# EAGLE design Ghidorah5_v2 (EAGLE 7.7.0)
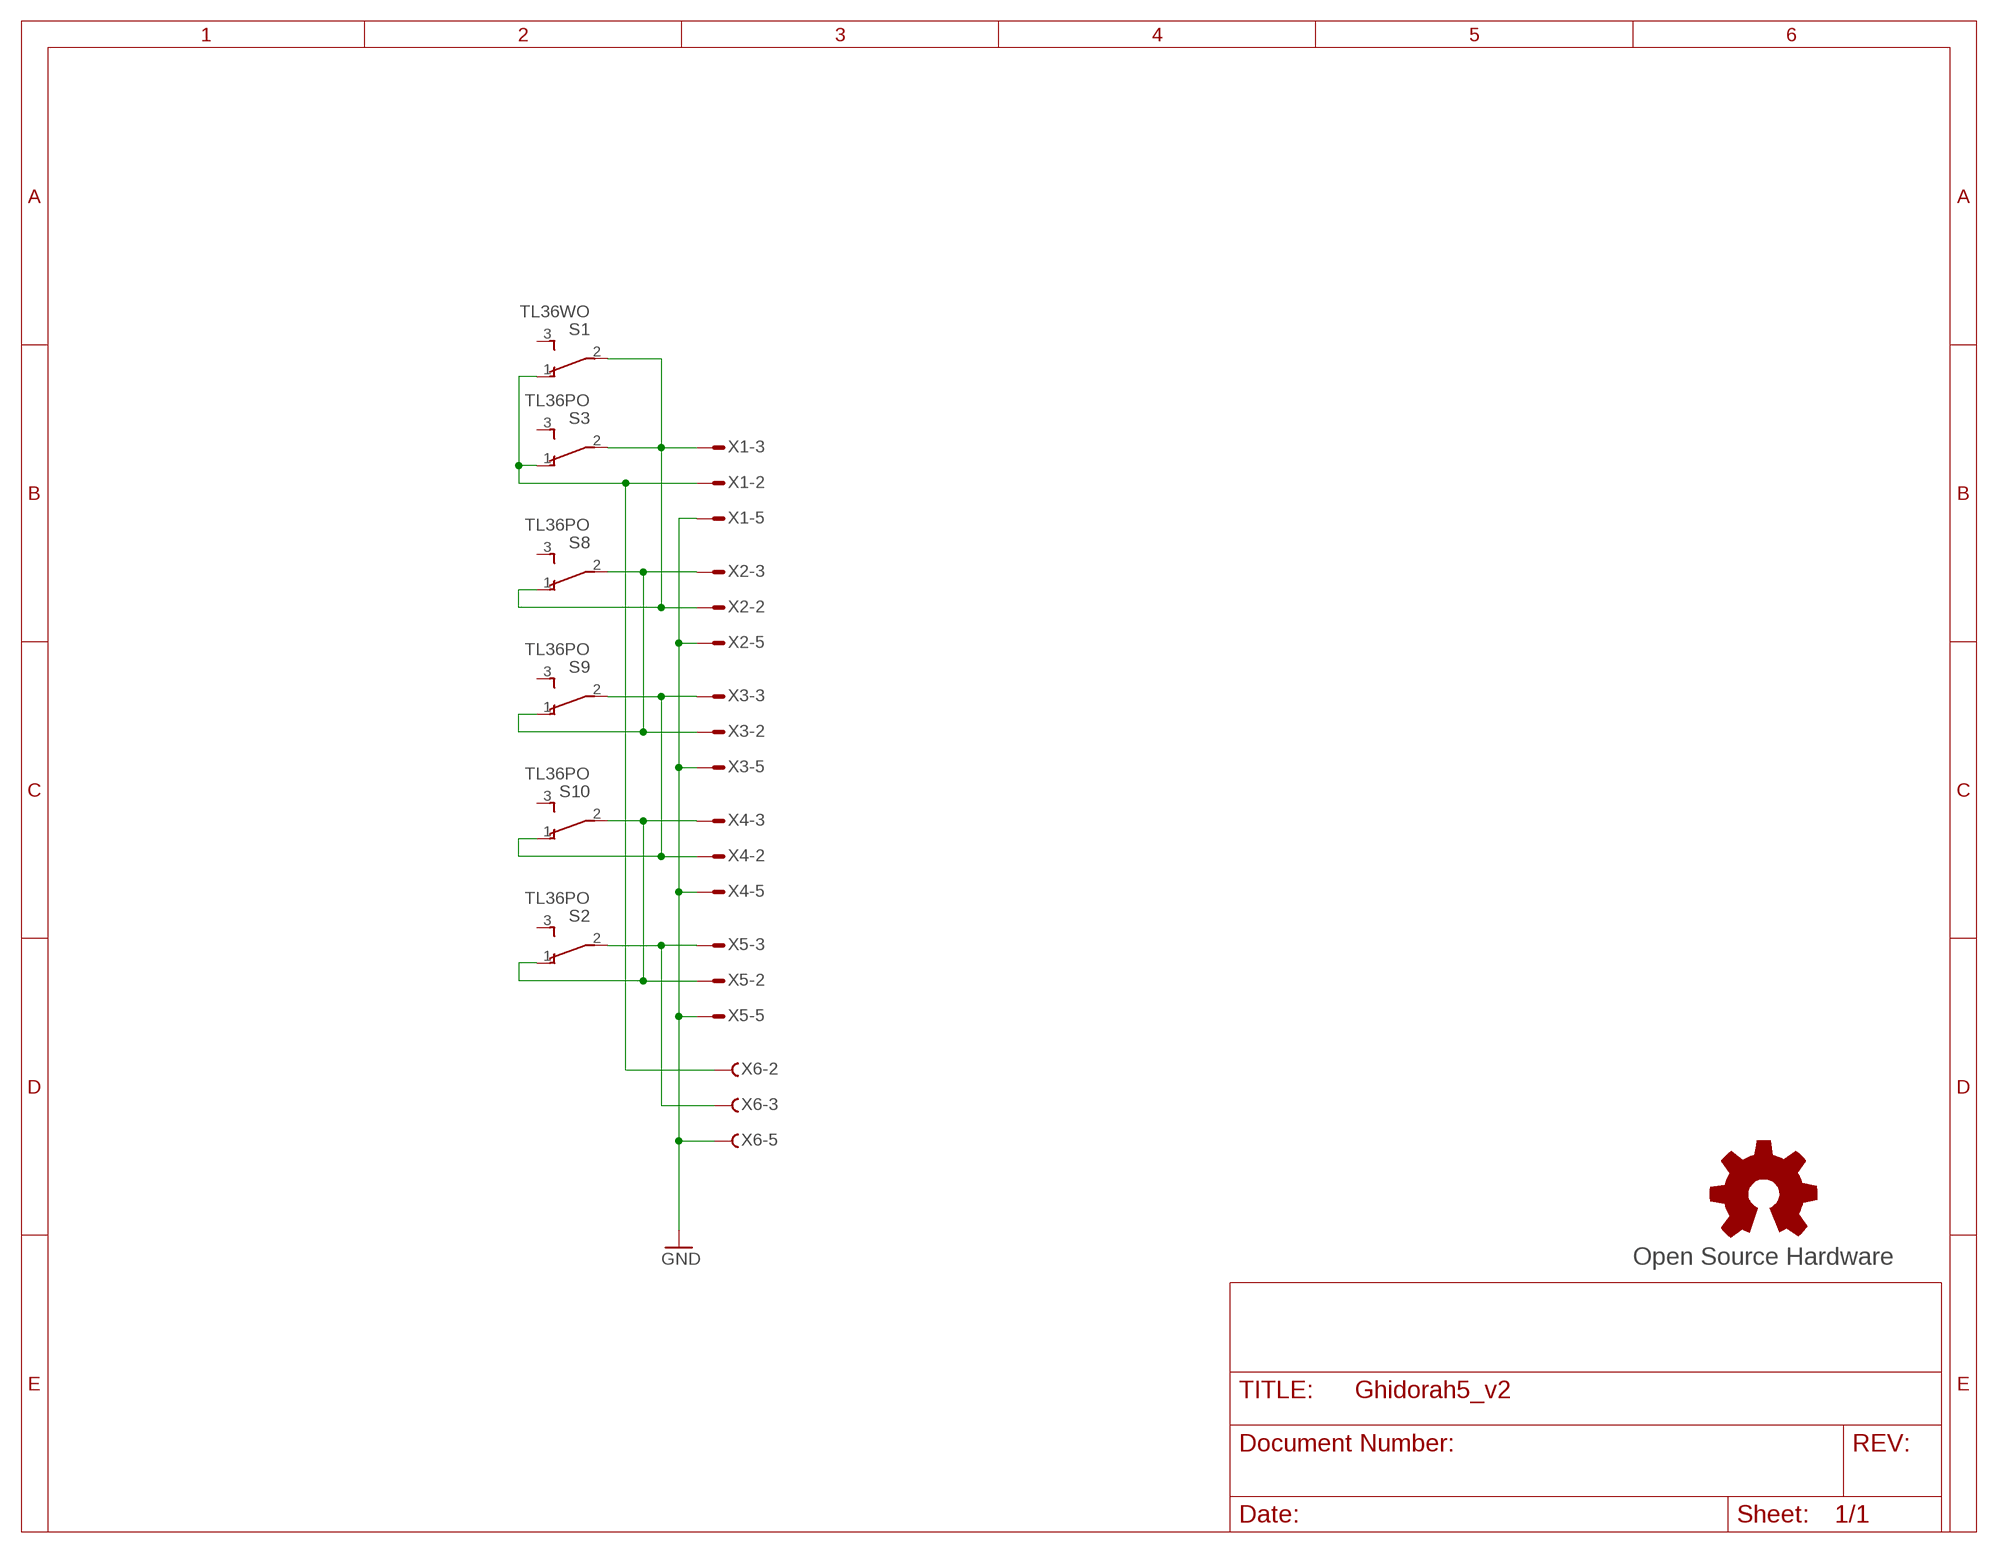
[diagram p0: schematic, sheet 1]

## Parts
GOLD_ORB_SM1  Open Source Hardware  OSHWLOGOLOGO5MM  [OSHW_5MM]
S1  TL36WO  [TL3XWO]
S2  TL36PO  [TL3XPO]
S3  TL36PO  [TL3XPO]
S8  TL36PO  [TL3XPO]
S9  TL36PO  [TL3XPO]
S10  TL36PO  [TL3XPO]
X1  M09DS  [M09D]
X2  M09VS  [M09V]
X3  M09VS  [M09V]
X4  M09VS  [M09V]
X5  M09VS  [M09V]
X6  F09DS  [F09D]

## Nets
2M: S1.1(O) S3.1(O) X1.2 X6.2
3F: S2.2(P) X5.3 X6.3
GND: X1.5 X2.5 X3.5 X4.5 X5.5 X6.5
N$1: S1.2(P) S3.2(P) S8.1(O) X1.3 X2.2
N$2: S8.2(P) S9.1(O) X2.3 X3.2
N$3: S9.2(P) S10.1(O) X3.3 X4.2
N$4: S2.1(O) S10.2(P) X4.3 X5.2
Unconnected: S1.3(S) S2.3(S) S3.3(S) S8.3(S) S9.3(S) S10.3(S) X1.1 X1.4 X1.6 X1.7 X1.8 X1.9 X2.1 X2.4 X2.6 X2.7 X2.8 X2.9 X3.1 X3.4 X3.6 X3.7 X3.8 X3.9 X4.1 X4.4 X4.6 X4.7 X4.8 X4.9 X5.1 X5.4 X5.6 X5.7 X5.8 X5.9 X6.1 X6.4 X6.6 X6.7 X6.8 X6.9

## Library data of the parts
GOLD_ORB_SM1 = oshw:OSHWLOGO: The OSHW logo for PCB layout
S1 = switch:TL36WO: TINY SWITCH ON - ON Source: http://www2.produktinfo.conrad.com/datenblaetter/700000-724999/705152-da-01-de-Subminiaturschalter_TL_36WO.pdf
S2 S3 S8-S10 = switch:TL36PO: TINY SWITCH ON - ON Source: http://www2.produktinfo.conrad.com/datenblaetter/700000-724999/705152-da-01-de-Subminiaturschalter_TL_36YO.pdf
X1-X5 = con-subd:M09?S: SUB-D; OC_FARNELL: unknown; OC_NEWARK: unknown
X6 = con-subd:F09?S: SUB-D; OC_FARNELL: unknown; OC_NEWARK: unknown

## Board
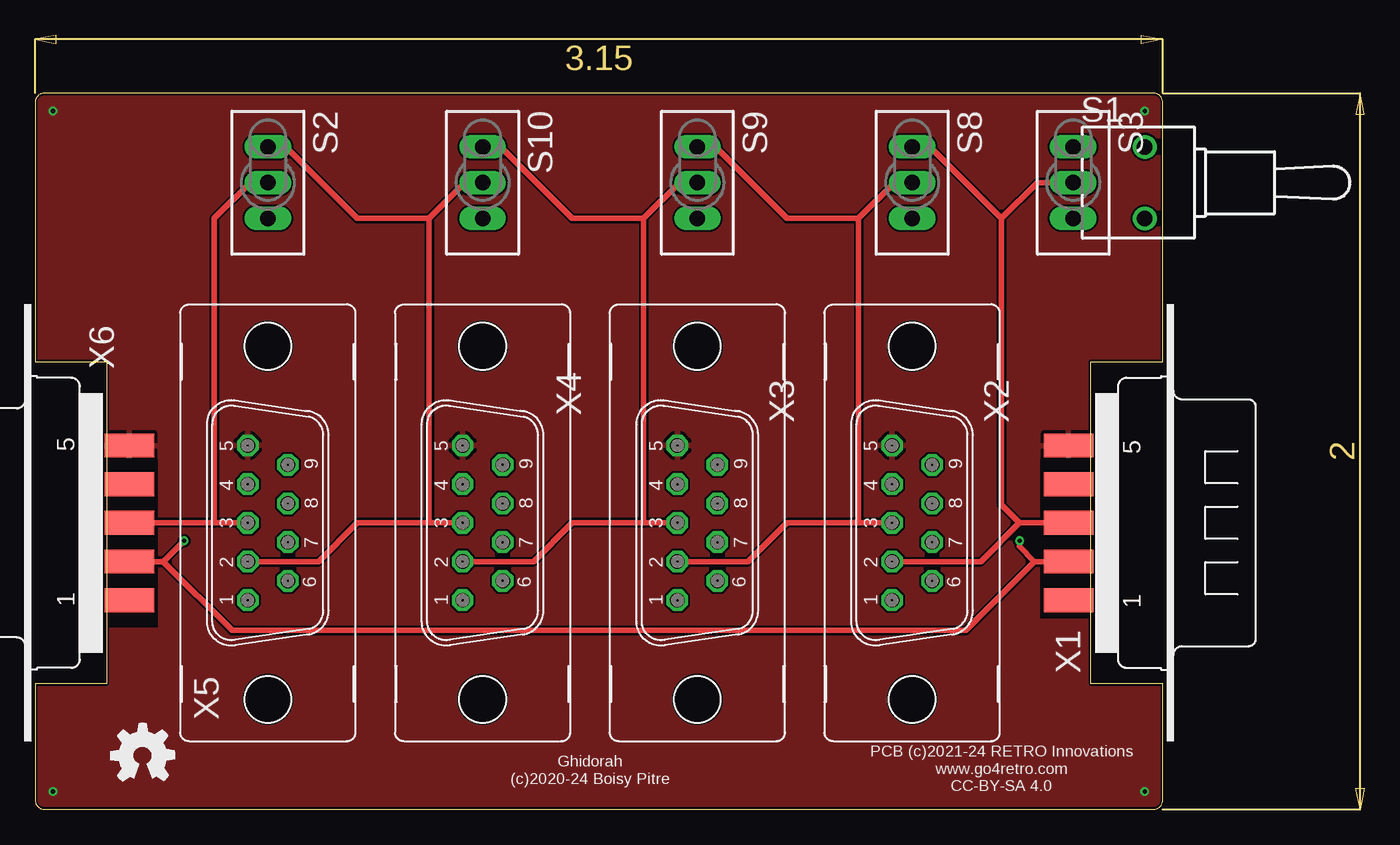
[diagram p1: board, top side]
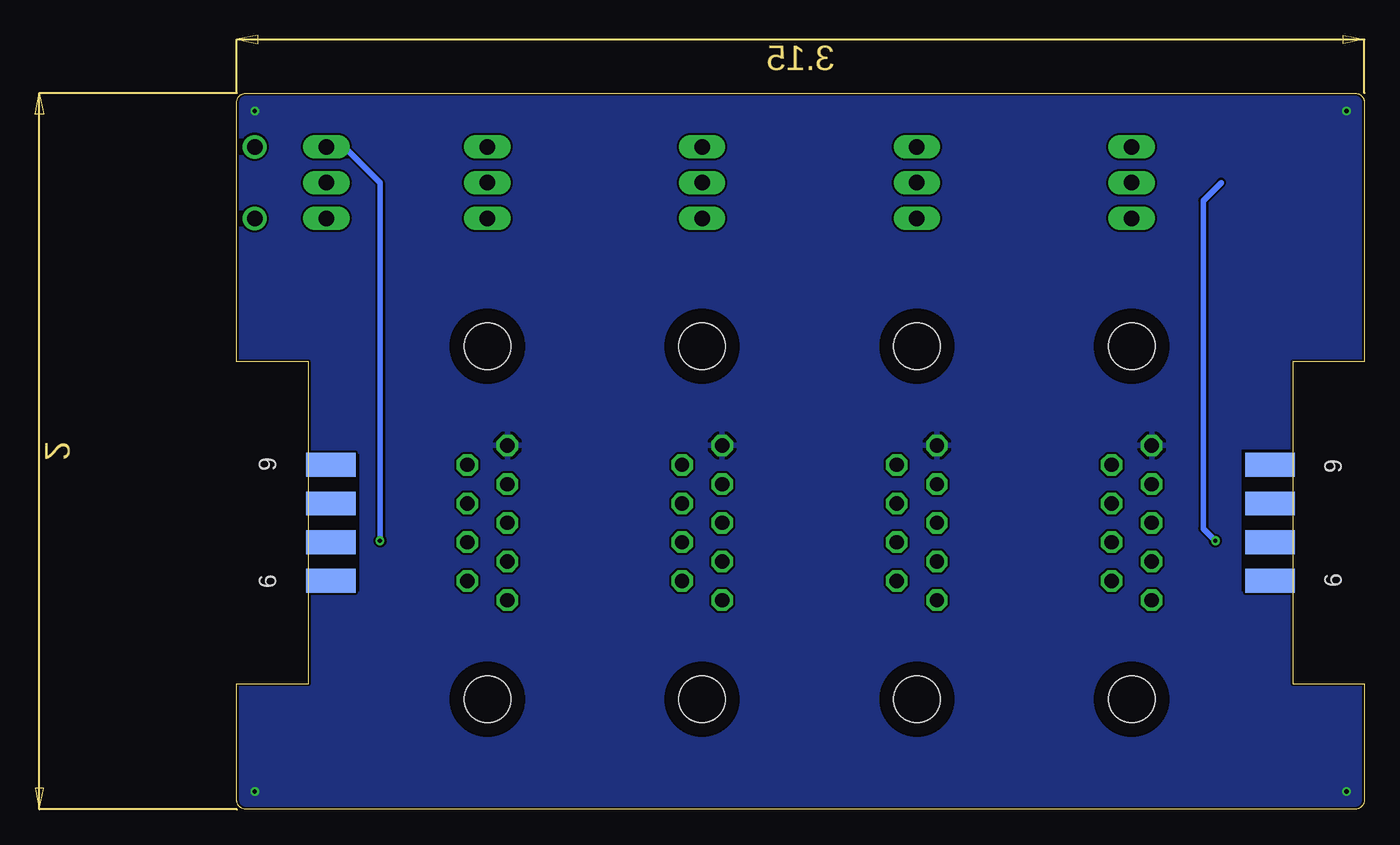
[diagram p2: board, bottom side, seen from below]

Size 80.01 x 50.8 mm. Coordinates in mm from the lower left corner, seen from the top.
Outline: 0.63,0 79.38,0 arc90 80.01,0.64 80.01,8.89 74.93,8.89 74.93,31.75 80.01,31.75 80.01,50.16 arc90 79.38,50.8 0.63,50.8 arc90 0,50.16 0,31.75 5.08,31.75 5.08,8.89 0,8.89 0,0.64 arc90 0.63,0
Copper layers (1*16): Top 0.035mm / dielectric 1.5mm / Bottom 0.035mm
Design rules "hackvana *": minimum track width 6mil, minimum drill 0.3mm, track to track 6mil, track to pad 6mil, pad to pad 6mil, via to via 6mil, smd to smd 0mil, copper to edge 6mil, drill to drill 6mil, minimum pad ring 10mil, minimum via ring 6mil, stop-mask expansion 2mil, vias tented up to drill 100mil, thermal gap 10mil

### Footprints (pad centres in the part's own frame; a part is rotated, then mirrored left to right if it is on the bottom)
TL3XWO = drill 1.1 pad 1.422 long: 1 -2.54,-5.08; 2 0,-5.08; 3 2.54,-5.08 | drill 1.1 pad 1.676: M1 -2.54,0; M2 2.54,0
TL3XPO = drill 1.1 pad 1.422 long: 1 -2.54,0; 2 0,0; 3 2.54,0
M09D = smd 1.7 x 3.5: 1 5.486,-6.045; 2 2.743,-6.045; 3 0,-6.045; 4 -2.743,-6.045; 5 -5.486,-6.045 | smd 1.7 x 3.5 bottom: 6 4.115,-6.045; 7 1.372,-6.045; 8 -1.372,-6.045; 9 -4.115,-6.045
M09V = drill 1.016 octagon: 1 -5.486,1.422; 2 -2.743,1.422; 3 0,1.422; 4 2.743,1.422; 5 5.486,1.422; 6 -4.115,-1.422; 7 -1.372,-1.422; 8 1.372,-1.422; 9 4.115,-1.422 | hole 3.302: -12.522,0; 12.522,0
F09D = smd 1.7 x 3.5: 1 -5.486,-6.045; 2 -2.743,-6.045; 3 0,-6.045; 4 2.743,-6.045; 5 5.486,-6.045 | smd 1.7 x 3.5 bottom: 6 -4.115,-6.045; 7 -1.372,-6.045; 8 1.372,-6.045; 9 4.115,-6.045

### Placement (x,y rotation side)
GOLD_ORB_SM1  7.62,3.81 0 top
S1  78.74,44.45 270 top
S2  16.51,44.45 270 top
S3  73.66,44.45 270 top
S8  62.23,44.45 270 top
S9  46.99,44.45 270 top
S10  31.75,44.45 270 top
X1  79.38,20.32 270 top
X2  62.23,20.32 90 top
X3  46.99,20.32 90 top
X4  31.75,20.32 90 top
X5  16.51,20.32 90 top
X6  0.63,20.32 90 top

### Tracks (layer width: path | path; a pad name or v marks a point on that pad's centre or on a via)
2M  (via drill 0.3)
  Top 0.406: X6.2 9.09,17.58 | 9.09,17.58 13.97,12.7 66.04,12.7 70.92,17.58 | X1.2 70.92,17.58 | 9.09,17.58 v10.57,19.05 | 70.92,17.58 69.85,18.64 v69.85,19.05
  Bottom 0.406: 10.16,44.45 11.43,43.18 11.43,19.91 v10.57,19.05 | v69.85,19.05 69.85,44.45 72.39,46.99 S1.1
3F
  Top 0.406: X5.3 12.7,20.32 | 12.7,20.32 X6.3 | S2.2 15.24,44.45 12.7,41.91 12.7,20.32
GND  (via drill 0.3)
  other vias: 78.74,49.53 1.27,49.53 1.27,1.27 78.74,1.27
  pour Top: 80.01,8.89 80.01,0.64 arc-90 79.38,0 0.63,0 arc-90 0,0.64 0,8.89 5.08,8.89 5.08,12.7 8.89,12.7 8.89,25.08 5.08,25.08 5.08,31.75 0,31.75 0,50.16 arc-90 0.63,50.8 79.38,50.8 arc-90 80.01,50.16 80.01,31.75 74.93,31.75 74.93,25.08 71.12,25.08 71.12,13.34 74.93,13.34 74.93,8.89
  pour Bottom: 80.01,8.89 80.01,0.64 arc-90 79.38,0 0.63,0 arc-90 0,0.64 0,8.89 5.08,8.89 5.08,15.24 8.89,15.24 8.89,25.72 5.08,25.72 5.08,31.75 0,31.75 0,50.16 arc-90 0.63,50.8 79.38,50.8 arc-90 80.01,50.16 80.01,31.75 74.93,31.75 74.93,25.4 71.12,25.4 71.12,15.24 74.93,15.24 74.93,8.89
N$1
  Top 0.406: X2.2 67.11,17.58 69.85,20.32 | X1.3 69.85,20.32 | 68.58,41.91 71.12,44.45 S1.2 | 68.58,41.91 68.58,21.59 69.85,20.32 | S8.1 63.5,46.99 68.58,41.91
N$2
  Top 0.406: X2.3 58.42,20.32 | 58.42,20.32 53.34,20.32 50.6,17.58 X3.2 | S8.2 60.96,44.45 58.42,41.91 | 58.42,41.91 58.42,20.32 | S9.1 48.26,46.99 53.34,41.91 58.42,41.91
N$3
  Top 0.406: X3.3 43.18,20.32 | 43.18,20.32 38.1,20.32 35.36,17.58 X4.2 | S9.2 45.72,44.45 43.18,41.91 | 43.18,41.91 43.18,20.32 | S10.1 33.02,46.99 38.1,41.91 43.18,41.91
N$4
  Top 0.406: X4.3 27.94,20.32 | 27.94,20.32 22.86,20.32 20.12,17.58 X5.2 | S10.2 30.48,44.45 27.94,41.91 | 27.94,41.91 27.94,20.32 | S2.1 17.78,46.99 22.86,41.91 27.94,41.91

### Text on the board
tNames: Ghidorah / (c)2020-24 Boisy Pitre | PCB (c)2021-24 RETRO Innovations / www.go4retro.com / CC-BY-SA 4.0